# Altium project TFT-ES32-V1.1.PrjPcb
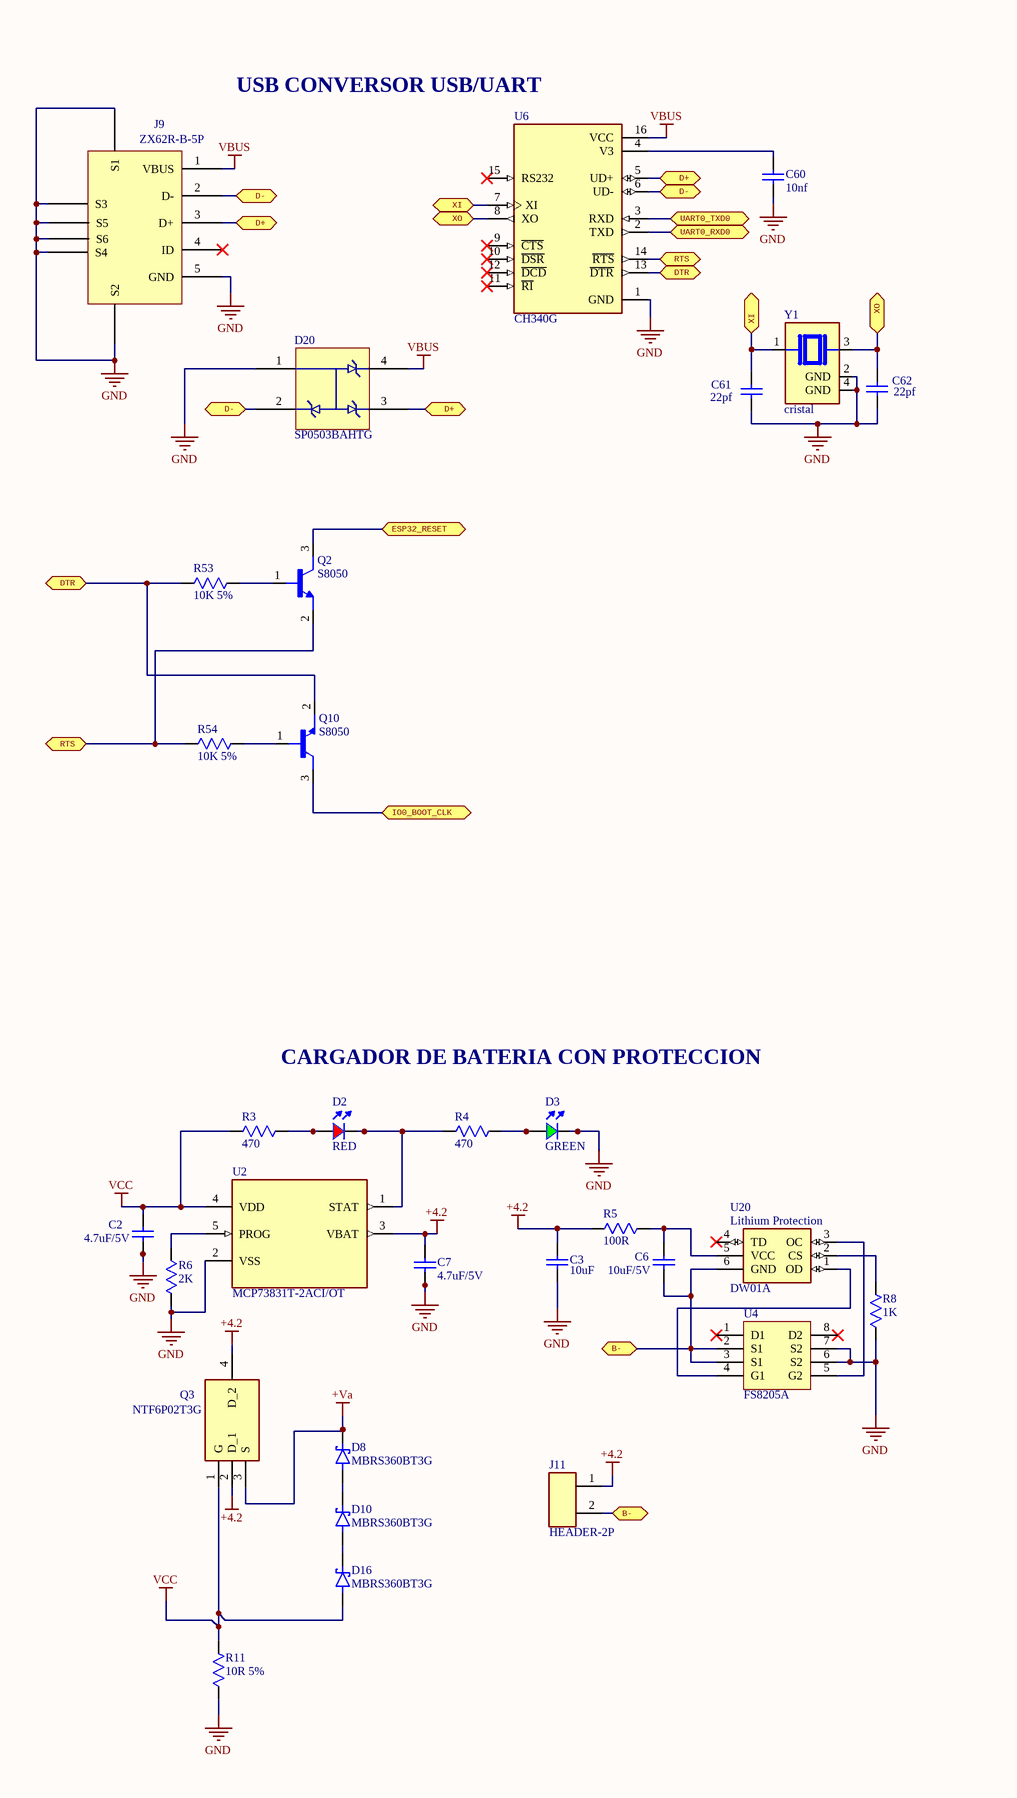
[diagram p0: TFT-ES32-V1.1.SchDoc, left]
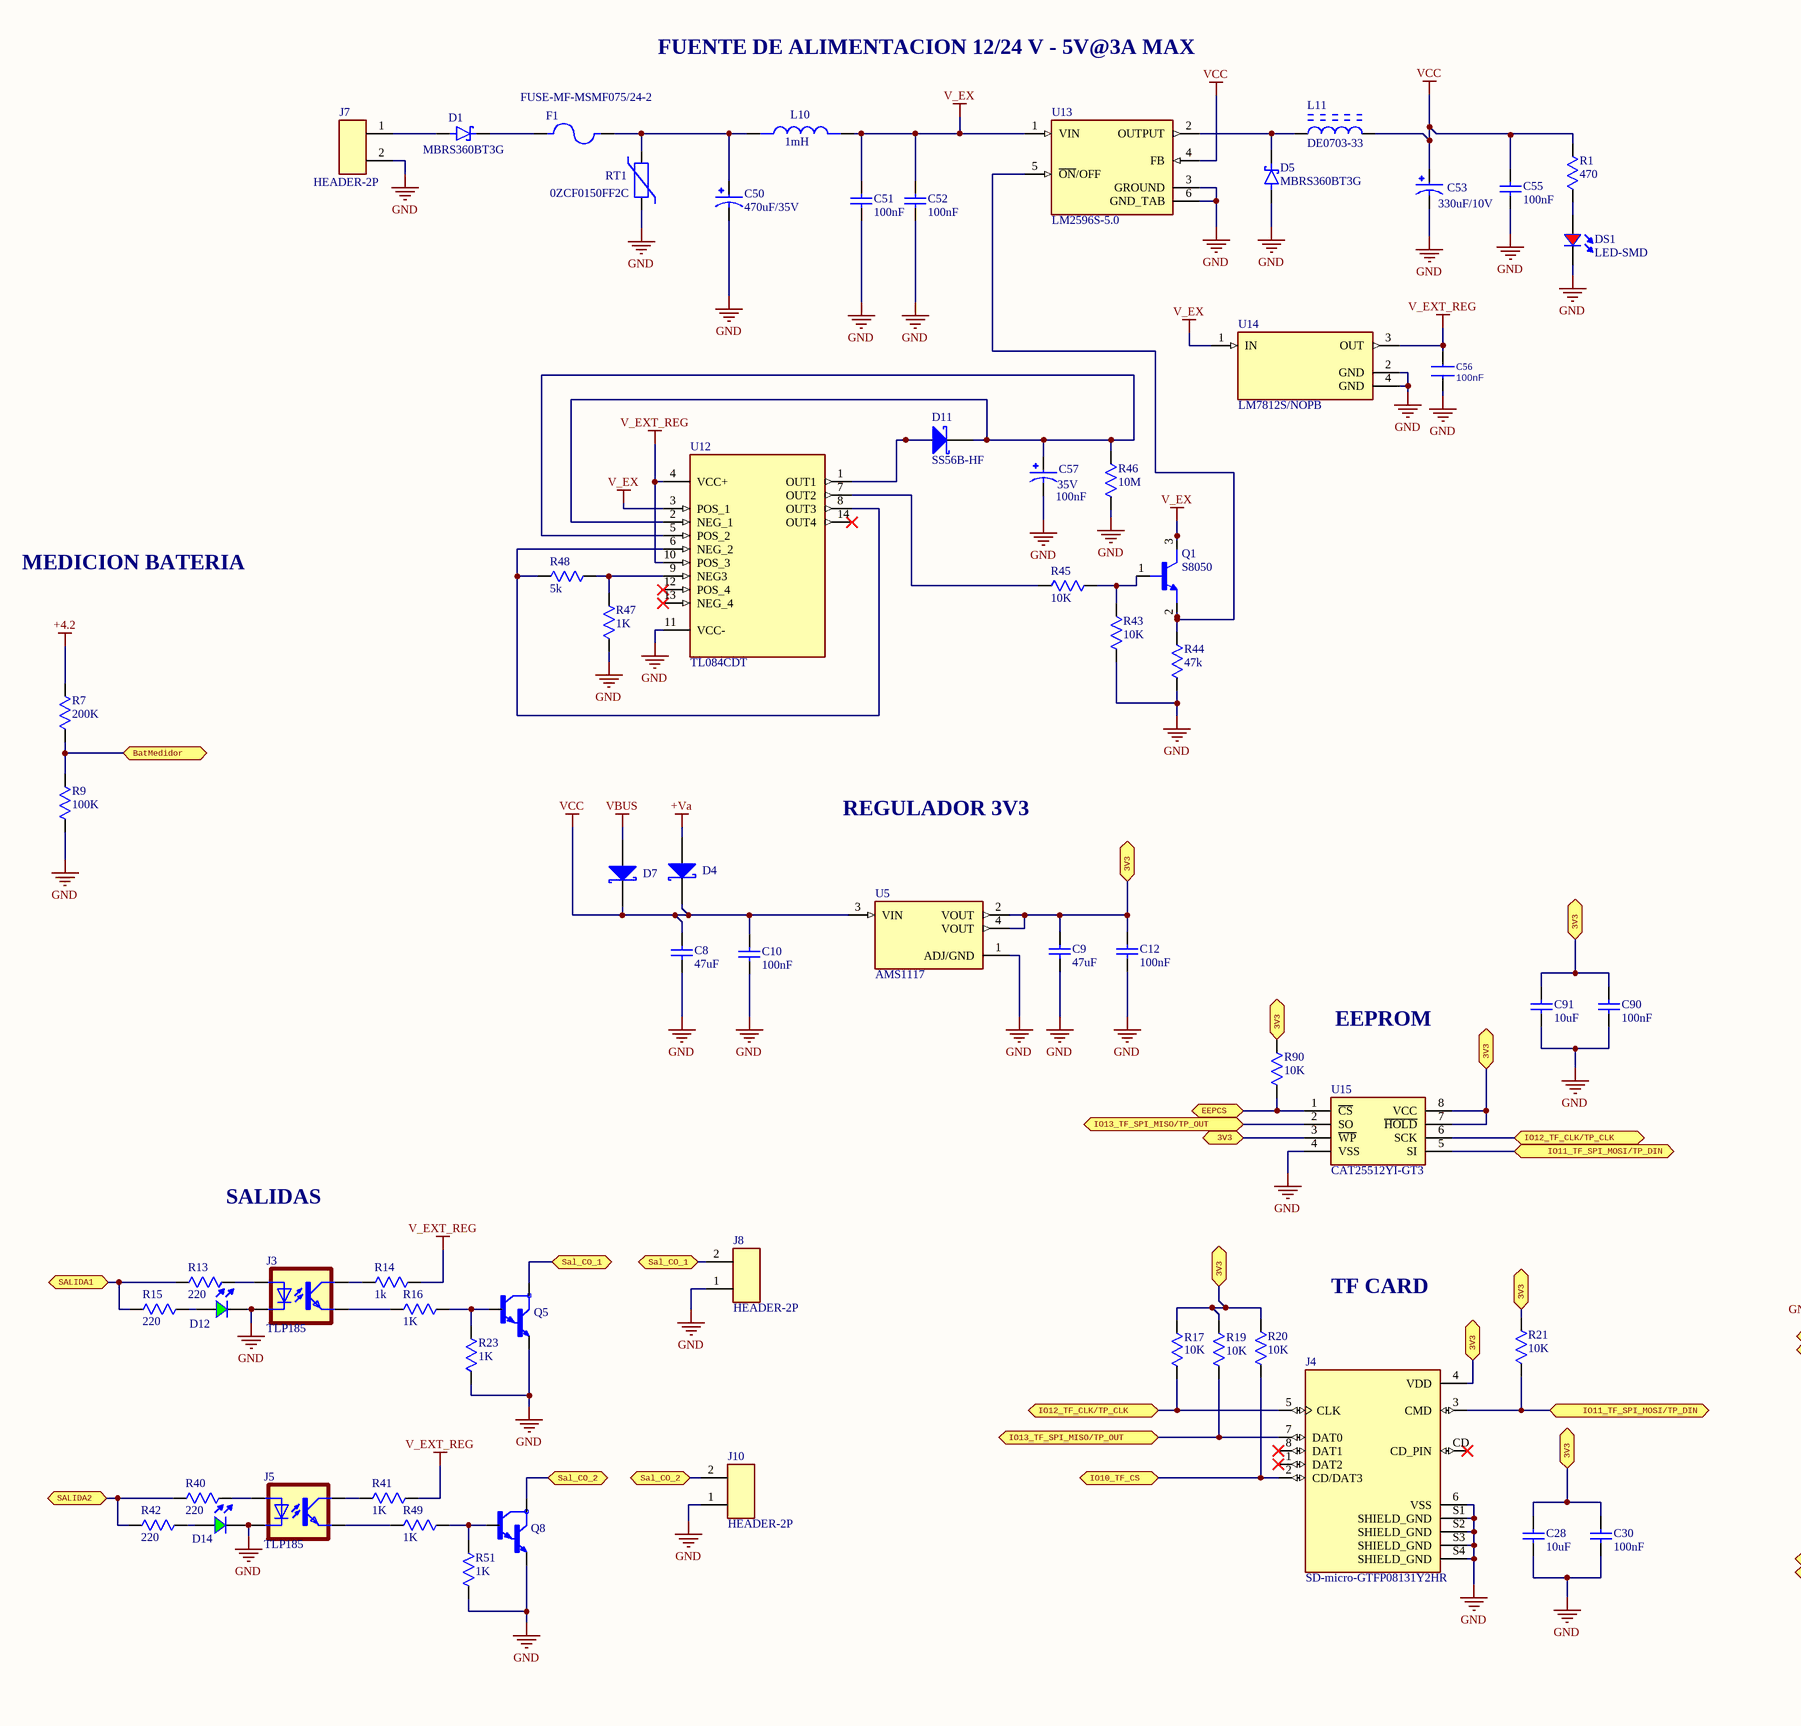
[diagram p1: TFT-ES32-V1.1.SchDoc, middle]
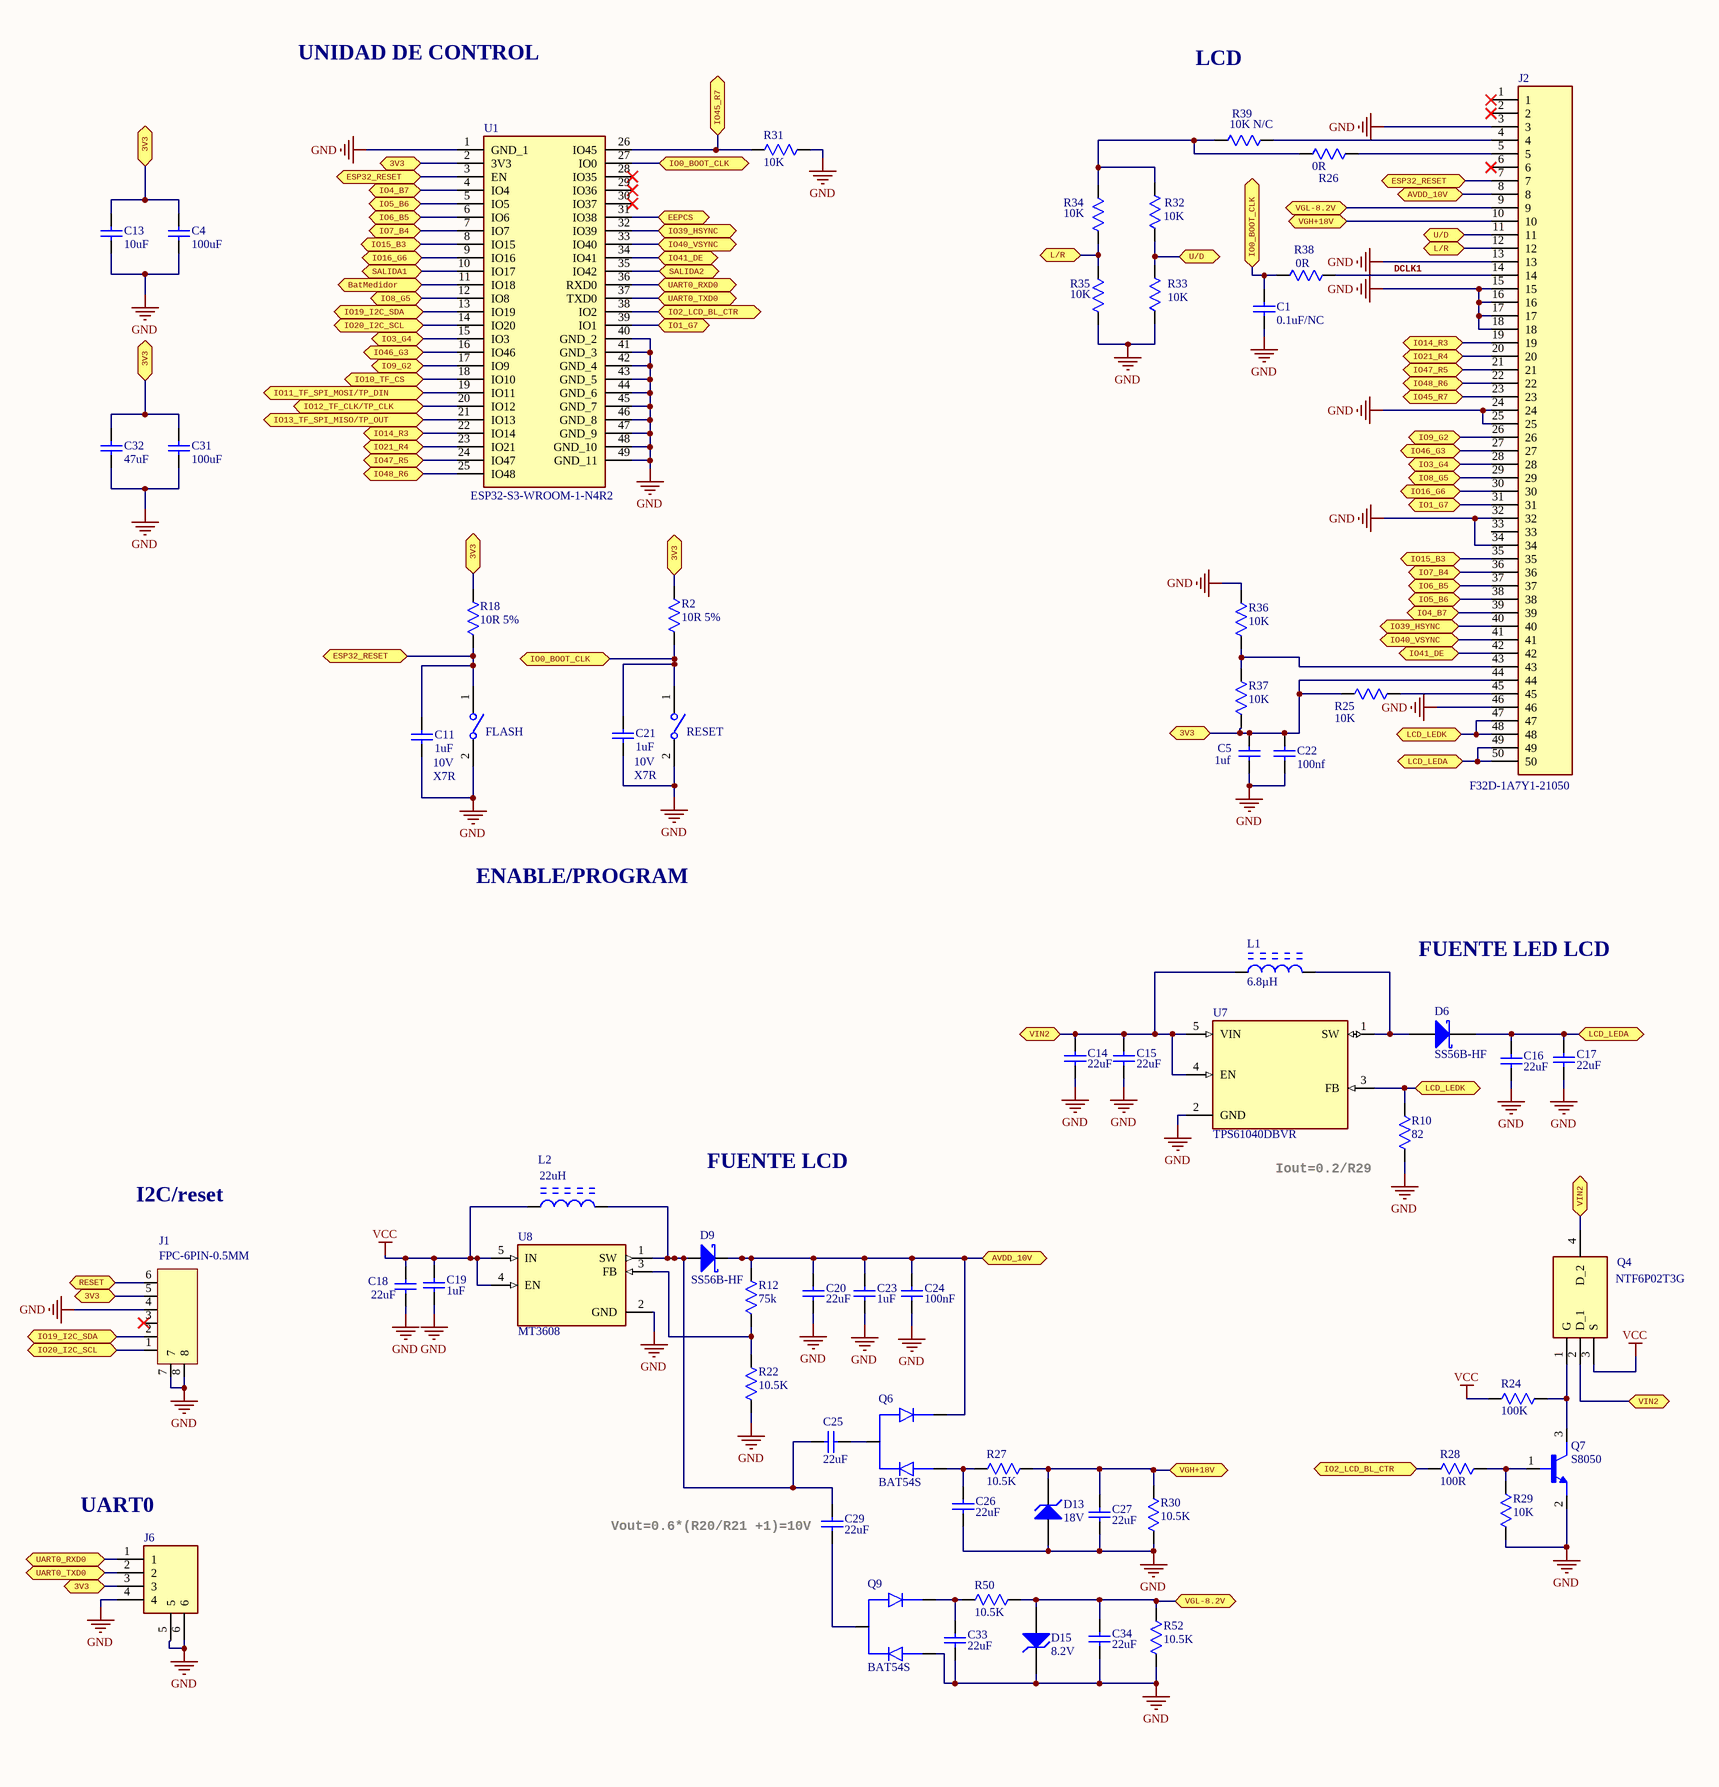
[diagram p2: TFT-ES32-V1.1.SchDoc, right]
1 sheet, 161 parts. Net scope: flat (ports and power ports of the same name join across sheets).
Board file: TFT-ES32-V1.1.PcbDoc

## Sheet TFT-ES32-V1.1.SchDoc
size 855 x 346 mm

### Parts
C1  0.1uF/NC  [C_0805-3D]
C2  4.7uF/5V  [C_0805-3D]
C3  10uF  [C_0805-3D]
C4  100uF  [C_0805-3D]
C5  1uf  [C_0805-3D]
C6  10uF/5V  [C_0805-3D]
C7  4.7uF/5V  [C_0805-3D]
C8  47uF  [C_0805-3D]
C9  47uF  [C_0805-3D]
C10  100nF  [C_0805-3D]
C11  1uF  tension: 10V  tipo: X7R  [C_0805-3D]
C12  100nF  [C_0805-3D]
C13  10uF  [C_0805-3D]
C14  value 22uF  [C_0805-3D]  (hidden comment: capacitor caramico)
C15  value 22uF  [C_0805-3D]  (hidden comment: capacitor caramico)
C16  value 22uF  [C_0805-3D]  (hidden comment: capacitor caramico)
C17  value 22uF  [C_0805-3D]  (hidden comment: capacitor caramico)
C18  value 22uF  [C_0805-3D]  (hidden comment: capacitor caramico)
C19  value 1uF  [C_0805-3D]  (hidden comment: capacitor caramico)
C20  value 22uF  [C_0805-3D]  (hidden comment: capacitor caramico)
C21  1uF  tension: 10V  tipo: X7R  [C_0805-3D]
C22  100nf  [C_0805-3D]
C23  value 1uF  [C_0805-3D]  (hidden comment: capacitor caramico)
C24  value 100nF  [C_0805-3D]  (hidden comment: capacitor caramico)
C25  value 22uF  [C_0805-3D]  (hidden comment: capacitor caramico)
C26  value 22uF  [C_0805-3D]  (hidden comment: capacitor caramico)
C27  value 22uF  [C_0805-3D]  (hidden comment: capacitor caramico)
C28  10uF  [C_0805-3D]
C29  value 22uF  [C_0805-3D]  (hidden comment: capacitor caramico)
C30  100nF  [C_0805-3D]
C31  100uF  [C_0805-3D]
C32  47uF  [C_0805-3D]
C33  value 22uF  [C_0805-3D]  (hidden comment: capacitor caramico)
C34  value 22uF  [C_0805-3D]  (hidden comment: capacitor caramico)
C50  470uF/35V  [CAP_EEEFP1V221AV - duplicate]
C51  100nF  [C_0805-3D]
C52  100nF  [C_0805-3D]
C53  330uF/10V  [CAP_EEEFP1V221AV - duplicate]
C55  100nF  [C_0805-3D]
C56  100nF  [C_0805]
C57  value 100nF  max volt: 35V  [CAP_EEEFP1V221AV - duplicate]  (hidden comment: CAP)
C60  10nf  [C_0805-3D]
C61  value 22pf  [C_0805-3D]  (hidden comment: capacitor caramico)
C62  value 22pf  [C_0805-3D]  (hidden comment: capacitor caramico)
C90  100nF  [C_0805-3D]
C91  10uF  [C_0805-3D]
D1  MBRS360BT3G  [DIOM5436X247N]
D2  RED  [D_0805-RED]
D3  GREEN  [D_0805-GREEN]
D4  SS56B-HF  [SS56B-HF DO-214AA (SMB)]  (value not drawn)
D5  MBRS360BT3G  [DIOM5436X247N]
D6  SS56B-HF  [SS56B-HF DO-214AA (SMB)]
D7  SS56B-HF  [SS56B-HF DO-214AA (SMB)]  (value not drawn)
D8  MBRS360BT3G  [DIOM5436X247N]
D9  SS56B-HF  [SS56B-HF DO-214AA (SMB)]
D10  MBRS360BT3G  [DIOM5436X247N]
D11  SS56B-HF  [SS56B-HF DO-214AA (SMB)]
D12  LTST-C171GKT  [D_0805-GREEN]  (value not drawn)
D13  18V  [SOD_123]
D14  LTST-C171GKT  [D_0805-GREEN]  (value not drawn)
D15  8.2V  [SOD_123]
D16  MBRS360BT3G  [DIOM5436X247N]
D20  SP0503BAHTG  [SOT143]
DS1  LED-SMD  [D_0805-RED]
F1  FUSE-MF-MSMF075/24-2  [FUSER_MF-MSMF075/24-2]
FLASH  buton-SMD  [SW_147873-2]  (value not drawn)
J1  FPC-6PIN-0.5MM  [68710614022]
J2  F32D-1A7Y1-21050  [AMPHENOL_F32D-1A7Y1-21050]
J3  TLP185  [SOP-4-2.54MM]
J4  SD-micro-GTFP08131Y2HR  [AMPHENOL_GTFP08131Y2HR]
J5  TLP185  [SOP-4-2.54MM]
J6  CONEC-4P-0.5MM-59453-041110ECHLF  [AMPHENOL_59453-041110ECHLF]  (value not drawn)
J7  HEADER-2P  [620102131822]
J8  HEADER-2P  [620102131822]
J9  ZX62R-B-5P  [HRS_ZX62R-B-5P]
J10  HEADER-2P  [620102131822]
J11  HEADER-2P  [620102131822]
L1  6.8µH  [DE0703-33]
L2  value 22uH  [DE0703-33]  (hidden comment: DE0703-33)
L10  1mH  [INDM5650X530N]
L11  DE0703-33  [DE0703-33]
Q1  S8050  [SOT-23]
Q2  S8050  [SOT-23]
Q3  NTF6P02T3G  [SOT230P700X175-4N]
Q4  NTF6P02T3G  [SOT230P700X175-4N]
Q5  MJD122  [DPAK]  (value not drawn)
Q6  BAT54S  [SOT95P240X120-3N]
Q7  S8050  [SOT-23]
Q8  MJD122  [DPAK]  (value not drawn)
Q9  BAT54S  [SOT95P240X120-3N]
Q10  S8050  [SOT-23]
R1  470  [R_0805]
R2  10R 5%  [R_0805]
R3  470  [R_0805]
R4  470  [R_0805]
R5  100R  [R_0805]
R6  2K  [R_0805]
R7  200K  [R_0805]
R8  1K  [R_0805]
R9  100K  [R_0805]
R10  82  [R_0805]
R11  10R 5%  [R_0805]
R12  75k  [R_0805]
R13  220  [R_0805]
R14  1k  [R_0805]
R15  220  [R_0805]
R16  1K  [R_0805]
R17  10K  [R_0805]
R18  10R 5%  [R_0805]
R19  10K  [R_0805]
R20  10K  [R_0805]
R21  10K  [R_0805]
R22  10.5K  [R_0805]
R23  1K  [R_0805]
R24  100K  [R_0805]
R25  10K  [R_0805]
R26  0R  [R_0805]
R27  10.5K  [R_0805]
R28  100R  [R_0805]
R29  10K  [R_0805]
R30  10.5K  [R_0805]
R31  10K  [R_0805]
R32  10K  [R_0805]
R33  10K  [R_0805]
R34  10K  [R_0805]
R35  10K  [R_0805]
R36  10K  [R_0805]
R37  10K  [R_0805]
R38  0R  [R_0805]
R39  10K N/C  [R_0805]
R40  220  [R_0805]
R41  1K  [R_0805]
R42  220  [R_0805]
R43  10K  [R_0805]
R44  47k  [R_0805]
R45  10K  [R_0805]
R46  10M  [R_0805]
R47  1K  [R_0805]
R48  5k  [R_0805]
R49  1K  [R_0805]
R50  10.5K  [R_0805]
R51  1K  [R_0805]
R52  10.5K  [R_0805]
R53  10K 5%  [R_0805]
R54  10K 5%  [R_0805]
R90  10K  [R_0805]
RESET  buton-SMD  [SW_147873-2]  (value not drawn)
RT1  0ZCF0150FF2C  [0ZCF]
U1  ESP32-S3-WROOM-1-N4R2  [ESP32S3WROOM1N4R2]
U2  MCP73831T-2ACI/OT  [SOT95P280X145-5N]
U4  FS8205A  [SOP65P640X120-8N]
U5  AMS1117  [SOT229P700X180-4N]
U6  CH340G  [SOIC127P600X180-16N]
U7  TPS61040DBVR  [SOT95P280X145-5N]
U8  MT3608  [SOT95P280X145-6N]
U12  TL084CDT  [SOIC127P600X175-14N]
U13  LM2596S-5.0  [TO170P1524X483-6N]
U14  LM7812S/NOPB  [TO254P1524X483-4N]
U15  CAT25512YI-GT3  [SOP65P640X120-8N]
U20  DW01A  [SOT-23-6]
Y1  cristal  [XTAL_ABM8G25000MHZB4YT3]

### Ports
3V3, AVDD_10V, B-, BatMedidor, D+, D-, DTR, EEPCS, ESP32_RESET, IO0_BOOT_CLK, IO1_G7, IO2_LCD_BL_CTR, IO3_G4, IO4_B7, IO5_B6, IO6_B5, IO7_B4, IO8_G5, IO9_G2, IO10_TF_CS, IO11_TF_SPI_MOSI/TP_DIN, IO12_TF_CLK/TP_CLK, IO13_TF_SPI_MISO/TP_OUT, IO14_R3, IO15_B3, IO16_G6, IO19_I2C_SDA, IO20_I2C_SCL, IO21_R4, IO39_HSYNC, IO40_VSYNC, IO41_DE, IO45_R7, IO46_G3, IO47_R5, IO48_R6, L/R, LCD_LEDA, LCD_LEDK, RESET, RTS, Sal_CO_1, Sal_CO_2, SALIDA1, SALIDA2, U/D, UART0_RXD0, UART0_TXD0, VGH+18V, VGL-8.2V, VIN2, XI, XO

### Nets
+4.2: C3.1 C7.2 J11.1 Q3.2(D_1) Q3.4(D_2) R5.2 R7.2 U2.3(VBAT)
+Va: D4.1 D8.C(K) Q3.3(S)
GND: C1.1 C2.1 C3.2 C4.1 C5.1 C7.1 C8.2 C9.2 C10.1 C11.1 C12.1 C13.2 C14.1 C15.1 C16.1 C17.1 C18.2 C19.1 C20.1 C21.1 C22.1 C23.1 C24.1 C26.1 C27.1 C28.2 C30.1 C31.1 C32.2 C33.1 C34.1 C50.2 C51.2 C52.1 C53.2 C55.1 C56.1 C57.2 C60.1 C61.1 C62.1 C90.1 C91.2 D3.2 D5.A D12.2 D13.1 D14.2 D15.2 D20.1 DS1.2 FLASH.2 J1.4 J1.7 J1.8 J2.3 J2.13 J2.15 J2.16 J2.17 J2.18 J2.24 J2.25 J2.32 J2.34 J2.46 J3.CATHODE(C) J4.6(VSS) J4.S1(SHIELD_GND) J4.S2(SHIELD_GND) J4.S3(SHIELD_GND) J4.S4(SHIELD_GND) J5.CATHODE(C) J6.4 J6.5 J6.6 J7.2 J8.1 J9.5(GND) J9.12(S1) J9.13(S3) J9.14(S5) J9.15(S6) J9.16(S2) J9.17(S4) J10.1 Q5.3(E) Q7.2(E) Q8.3(E) Q9.1 R6.1 R8.1 R9.1 R10.1 R11.2 R22.1 R23.1 R29.1 R30.1 R31.2 R33.1 R35.1 R36.2 R43.1 R44.1 R46.1 R47.1 R51.2 R52.1 RESET.2 RT1.1 U1.1(GND_1) U1.40(GND_2) U1.41(GND_3) U1.42(GND_4) U1.43(GND_5) U1.44(GND_6) U1.45(GND_7) U1.46(GND_8) U1.47(GND_9) U1.48(GND_10) U1.49(GND_11) U2.2(VSS) U4.6(S2) U4.7(S2) U5.1(ADJ/GND) U6.1(GND) U7.2(GND) U8.2(GND) U12.11(VCC-) U13.3(GROUND) U13.6(GND_TAB) U14.2(GND) U14.4(GND) U15.4(VSS) Y1.2(GND) Y1.4(GND)
V_EX: C51.1 C52.2 L10.2 Q1.3(C) U12.3(POS_1) U13.1(VIN) U14.1(IN)
V_EXT_REG: C56.2 R14.2 R41.1 U12.4(VCC+) U12.10(POS_3) U14.3(OUT)
VBUS: D7.1 D20.4 J9.1(VBUS) U6.16(VCC)
VCC: C2.2 C8.1 C10.2 C18.1 C19.2 C53.1 C55.2 D4.2 D7.2 D16.A L2.1 L11.2 Q3.1(G) Q4.3(S) R1.2 R3.1 R11.1 R24.2 U2.4(VDD) U5.3(VIN) U8.4(EN) U8.5(IN) U13.4(FB)
DCLK1: J2.14 R38.2
NetC1_2: C1.2 C21.2 Q10.3 R2.1 R38.1 RESET.1 U1.27(IO0) ; port IO0_BOOT_CLK
NetC4_2: C4.2 C5.2 C9.1 C12.2 C13.1 C22.2 C28.1 C30.2 C31.2 C32.1 C90.2 C91.1 J1.5 J2.44 J4.4(VDD) J6.3 R2.2 R17.2 R18.2 R19.2 R20.2 R21.2 R25.2 R37.1 R90.2 U1.2(3V3) U5.2(VOUT) U5.4(VOUT) U15.3(~{WP}) U15.7(~{HOLD}) U15.8(VCC) ; port 3V3
NetC6_1: C6.1 R5.1 U20.5(VCC)
NetC6_2: C6.2 J11.2 U4.2(S1) U4.3(S1) U20.6(GND) ; port B-
NetC11_2: C11.2 FLASH.1 J2.7 Q2.3(C) R18.1 U1.3(EN) ; port ESP32_RESET
NetC14_2: C14.2 C15.2 L1.1 Q4.2(D_1) Q4.4(D_2) U7.4(EN) U7.5(VIN) ; port VIN2
NetC16_2: C16.2 C17.2 D6.2 J2.49 J2.50 ; port LCD_LEDA
NetC20_2: C20.2 C23.2 C24.2 D9.2 J2.8 Q6.2 R12.2 ; port AVDD_10V
NetC25_1: C25.1 Q6.3
NetC25_2: C25.2 C29.2 D9.1 L2.2 U8.1(SW)
NetC26_2: C26.2 Q6.1 R27.2
NetC27_2: C27.2 D13.2 J2.10 R27.1 R30.2 ; port VGH+18V
NetC29_1: C29.1 Q9.3
NetC33_2: C33.2 Q9.2 R50.2
NetC34_2: C34.2 D15.1 J2.9 R50.1 R52.2 ; port VGL-8.2V
NetC50_1: C50.1 F1.2 L10.1 RT1.2
NetC57_1: C57.1 D11.2 R46.2 U12.2(NEG_1) U12.5(POS_2)
NetC60_2: C60.2 U6.4(V3)
NetC61_2: C61.2 U6.7(XI) Y1.1 ; port XI
NetC62_2: C62.2 U6.8(XO) Y1.3 ; port XO
NetD1_A: D1.A J7.1
NetD1_C: D1.C(K) F1.1
NetD2_1: D2.1 R3.2
NetD2_2: D2.2 R4.1 U2.1(STAT)
NetD3_1: D3.1 R4.2
NetD5_C: D5.C(K) L11.1 U13.2(OUTPUT)
NetD6_1: D6.1 L1.2 U7.1(SW)
NetD8_A: D8.A D10.C(K)
NetD10_A: D10.A D16.C(K)
NetD11_1: D11.1 U12.1(OUT1)
NetD12_1: D12.1 R15.2
NetD14_1: D14.1 R42.1
NetD20_2: D20.2 J9.2(D-) U6.6(UD-) ; port D-
NetD20_3: D20.3 J9.3(D+) U6.5(UD+) ; port D+
NetDS1_1: DS1.1 R1.1
NetJ1_1: J1.1 U1.14(IO20) ; port IO20_I2C_SCL
NetJ1_2: J1.2 U1.13(IO19) ; port IO19_I2C_SDA
NetJ1_6: J1.6 ; port RESET
NetJ2_4: J2.4 R39.2
NetJ2_5: J2.5 R26.2
NetJ2_11: J2.11 R32.1 R33.2 ; port U/D
NetJ2_12: J2.12 R34.1 R35.2 ; port L/R
NetJ2_19: J2.19 U1.22(IO14) ; port IO14_R3
NetJ2_20: J2.20 U1.23(IO21) ; port IO21_R4
NetJ2_21: J2.21 U1.24(IO47) ; port IO47_R5
NetJ2_22: J2.22 U1.25(IO48) ; port IO48_R6
NetJ2_23: J2.23 R31.1 U1.26(IO45) ; port IO45_R7
NetJ2_26: J2.26 U1.17(IO9) ; port IO9_G2
NetJ2_27: J2.27 U1.16(IO46) ; port IO46_G3
NetJ2_28: J2.28 U1.15(IO3) ; port IO3_G4
NetJ2_29: J2.29 U1.12(IO8) ; port IO8_G5
NetJ2_30: J2.30 U1.9(IO16) ; port IO16_G6
NetJ2_31: J2.31 U1.39(IO1) ; port IO1_G7
NetJ2_35: J2.35 U1.8(IO15) ; port IO15_B3
NetJ2_36: J2.36 U1.7(IO7) ; port IO7_B4
NetJ2_37: J2.37 U1.6(IO6) ; port IO6_B5
NetJ2_38: J2.38 U1.5(IO5) ; port IO5_B6
NetJ2_39: J2.39 U1.4(IO4) ; port IO4_B7
NetJ2_40: J2.40 U1.32(IO39) ; port IO39_HSYNC
NetJ2_41: J2.41 U1.33(IO40) ; port IO40_VSYNC
NetJ2_42: J2.42 U1.34(IO41) ; port IO41_DE
NetJ2_43: J2.43 R36.1 R37.2
NetJ2_45: J2.45 R25.1
NetJ2_47: J2.47 J2.48 R10.2 U7.3(FB) ; port LCD_LEDK
NetJ3_ANODE: J3.ANODE(A) R13.2
NetJ3_COLLECTOR: J3.COLLECTOR(COL) R14.1
NetJ3_EMITTER: J3.EMITTER(EMIT) R16.1
NetJ4_2: J4.2(CD/DAT3) R20.1 U1.18(IO10) ; port IO10_TF_CS
NetJ4_3: J4.3(CMD) R21.1 U1.19(IO11) U15.5(SI) ; port IO11_TF_SPI_MOSI/TP_DIN
NetJ4_5: J4.5(CLK) R17.1 U1.20(IO12) U15.6(SCK) ; port IO12_TF_CLK/TP_CLK
NetJ4_7: J4.7(DAT0) R19.1 U1.21(IO13) U15.2(SO) ; port IO13_TF_SPI_MISO/TP_OUT
NetJ5_ANODE: J5.ANODE(A) R40.1
NetJ5_COLLECTOR: J5.COLLECTOR(COL) R41.2
NetJ5_EMITTER: J5.EMITTER(EMIT) R49.2
NetJ6_1: J6.1 U1.36(RXD0) U6.2(TXD) ; port UART0_RXD0
NetJ6_2: J6.2 U1.37(TXD0) U6.3(RXD) ; port UART0_TXD0
NetJ8_2: J8.2 Q5.4(C) ; port Sal_CO_1
NetJ10_2: J10.2 Q8.4(C) ; port Sal_CO_2
NetQ1_1: Q1.1(B) R43.2 R45.2
NetQ1_2: Q1.2(E) R44.2 U13.5(~{ON}/OFF)
NetQ2_1: Q2.1(B) R53.2
NetQ2_2: Q2.2(E) R54.1 U6.14(~{RTS}) ; port RTS
NetQ4_1: Q4.1(G) Q7.3(C) R24.1
NetQ5_1: Q5.1(B) R16.2 R23.2
NetQ7_1: Q7.1(B) R28.1 R29.2
NetQ8_1: Q8.1(B) R49.1 R51.1
NetQ10_1: Q10.1(B) R54.2
NetQ10_2: Q10.2(E) R53.1 U6.13(~{DTR}) ; port DTR
NetR6_2: R6.2 U2.5(PROG)
NetR7_1: R7.1 R9.2 U1.11(IO18) ; port BatMedidor
NetR8_2: R8.2 U20.2(CS)
NetR12_1: R12.1 R22.2 U8.3(FB)
NetR13_1: R13.1 R15.1 U1.10(IO17) ; port SALIDA1
NetR26_1: R26.1 R32.2 R34.2 R39.1
NetR28_2: R28.2 U1.38(IO2) ; port IO2_LCD_BL_CTR
NetR40_2: R40.2 R42.2 U1.35(IO42) ; port SALIDA2
NetR45_1: R45.1 U12.7(OUT2)
NetR47_2: R47.2 R48.2 U12.9(NEG3)
NetR48_1: R48.1 U12.6(NEG_2) U12.8(OUT3)
NetR90_1: R90.1 U1.31(IO38) U15.1(~{CS}) ; port EEPCS
NetU4_4: U4.4(G1) U20.1(OD)
NetU4_5: U4.5(G2) U20.3(OC)

Not connected (* = marked no-connect by the designer): J1 3(4)*; J2 1* 2* 6* 33; J4 1(DAT2)* 8(DAT1)* CD(CD_PIN)*; J9 4(ID)*; U1 28(IO35)* 29(IO36)* 30(IO37)*; U4 1(D1)* 8(D2)*; U6 9(~{CTS})* 10(~{DSR})* 11(~{RI})* 12(~{DCD})* 15(RS232)*; U12 12(POS_4)* 13(NEG_4)* 14(OUT4)*; U20 4(TD)*

### Notes on the sheet
- FUENTE DE ALIMENTACION 12/24 V - 5V@3A MAX
- UNIDAD DE CONTROL
- LCD
- USB CONVERSOR USB/UART
- MEDICION BATERIA
- REGULADOR 3V3
- ENABLE/PROGRAM
- FUENTE LED LCD
- EEPROM
- CARGADOR DE BATERIA CON PROTECCION
- FUENTE LCD
- Iout=0.2/R29
- SALIDAS
- I2C/reset
- TF CARD
- (near J6) UART0
- Vout=0.6*(R20/R21 +1)=10V
- (in symbol DW01A) Lithium Protection

### Library data of the parts
C1-C34 C51 C52 C55 C60-C62 C90 C91 = capacitor caramico: capacitor ceramico 0805
C50 C53 = CAP_EEEFP1V221AV: CAP ALUM; max volt: 50V
C56 = CapMix: Capacitor; Value: 100nF
C57 = CAP_EEEFP1V221AV: CAP ALUM
D1 D5 D8 D10 D16 = MBRS360BT3G: Diode Schottky 60V 3A Surface Mount SMB
D2 DS1 = LED-SMD: led 0805 red
D3 = LED-SMD-GREEN: value: LTST-C171GKT
D4 D6 D7 D9 D11 = SS56B-HF: Diodo Schottky 60 V 5A Montaje en superficie DO-214AA (SMB); part number: SS56B-HF; value: Diodo Schottky 60 V 5A; pakage: DO-214AA (SMB)
D12 D14 = LED-SMD-GREEN
D13 = Diodo Zener-MMSZ5231BT1G: Diodo Zener 18V SMD SOD-123
D15 = Diodo Zener-MMSZ5231BT1G: Diodo Zener  8.2V  SOD-123
D20 = SP0503BAHTG: Supresor ESD TVS Uni-Dir 5.5V 4-Pin SOT-143 T/R
F1 = FUSE-MF-MSMF075/24-2: Polymeric PTC Resettable Fuse 24V 750 mA Ih Surface Mount 1812 (4532 Metric), Concave
J1 = FPC-CONEC-6P-68710614022: Position FPC Connector Contacts, Top 0.020" (0.50mm) Surface Mount, Right Angle
J2 = F32D-1A7Y1-21050: Flex Connector, 0.50mm Pitch, Height 2.00mm, Right angle, Flip type, ZIF, Double contact, point 50 position , Without MYLAR; MF: Amphenol ICC (FCI); Package: None; Price: None; Check_prices: https://www.snapeda.com/parts/F32D-1A7Y1-21050/Amphenol+FCI/view-part/?ref=eda; Value: *; SnapEDA_Link: https://www.snapeda.com/parts/F32D-1A7Y1-21050/Amphenol+FCI/view-part/?ref=snap; MP: F32D-1A7Y1-21050; Availability: In Stock; Purchase-URL: https://pricing.snapeda.com/search?q=F32D-1A7Y1-21050&ref=eda
J3 J5 = TLP185: Optoisolator Transistor Output 3750Vrms 1 Channel 6-SOP; MF: Toshiba; Price: None; Availability: In Stock; MP: TLP185; Package: None; SnapEDA_Link: https://www.snapeda.com/parts/TLP185/Toshiba/view-part/?ref=snap; Check_prices: https://www.snapeda.com/parts/TLP185/Toshiba/view-part/?ref=eda; Value: *; Purchase-URL: https://pricing.snapeda.com/search/part/TLP185/?ref=eda
J4 = SD-micro-GTFP08131Y2HR: GTFP08131Y2HR  MICRO SD,P/P,LCP; MF: GTFP08131Y2HR
J6 = CONEC-4P-0.5MM-59453-041110ECHLF: 0.50mm Flex Connectors, FPC/FFC Side Entry ZIF Connector, Surface Mount, 4 Positions, Bottom Contact, 0.50mm (0.020in) Pitch
J7 J8 J10 J11 = HEADER-2P-620102131822: Connector Header Surface Mount, Right Angle 2 position 0.079 _2.00mm_
J9 = USB-ZX62R-B-5P: ZX62R-B-5P USB STM; tecnoligi: SMD; value: ZX62R-B-5P
L1 L2 L11 = DE0703-33: Inductor: alambre; SMD; 33uH; 910mA; 240 mΩ; 7,3x7,3x3,2 mm; ±20%
L10 = B82442T1105K050: INDUCTOR, 2220A, 1000UH, 0.246A, 10%; Inductance:1mH; Inductance Tolerance:Â± 10%; DC Resistance Max:9.5ohm; DC Current Rating:150mA; Series:SIMID; Core Material:Ferrite; Inductor Case Style:2220; No. of Pins:2; Core Material:Ferrite; DC Current Max:150mA; Inductor Type:Laser Cut; Package / Case:2220; Q @ Vr F:20; Q Factor @ Frequency:20 @ 252kHz; Resistance:9.5ohm; Resonant Frequency:1.8MHz
Q1 Q2 Q7 = transistor-smd-NPN-BJT: Transistor bipolar (BJT) NPN 25 V 500 mA 150 MHz 300 mW Montaje en superficie SOT-23
Q3 Q4 = NTF6P02T3G: 10A, 20V, 0.05ohm, P-CHANNEL, Si, POWER, MOSFET, TO-261AA, CASE 318E-04, TO-261, 4 PIN
Q5 Q8 = MJD122: Bipolar _BJT_ Transistor NPN - Darlington 100V 8A 4MHz 1.75W Surface Mount DPAK; MF: ON Semiconductor
Q6 Q9 = BAT54S: SOT-23 30V 0.2A Diodes Rectifi
Q10 = transistor-smd-NPN-BJT-espejado: Transistor bipolar (BJT) NPN 25 V 500 mA 150 MHz 300 mW Montaje en superficie SOT-23
R1-R54 R90 = Resistor
RT1 = 0ZCF0150FF2C: PPTC (Polyswitch); Vendor: Belfuse; Manufacturer_Part_Number: 0ZCF0150FF2C; Type: Type; RefDes: RefDes
U1 = ESP32-S3-WROOM-1-N4R2: Bluetooth, WiFi 802.11b/g/n, Bluetooth v5.0 Transceiver Module 2.4GHz PCB Trace Surface Mount
U2 = MCP73831T-2ACI/OT: Charger IC Lithium Ion/Polymer SOT-23-5; MF: Microchip; MP: MCP73831T-2ACI/OT; package: SOT-23 Microchip
U5 = AMS1117: 1A LOW DROPOUT VOLTAGE REGULATOR SOT-223; MP: AMS1117; MF: SOT-223
U6 = CH340G: USB Interface Integrated Circuit; MF: WCH; MP: CH340G
U7 = TPS61040DBVR: 28-V, 400-mA Switch Boost Converter in SOT-23 for LCD and White LED Applications
U8 = MT3608: High Efficiency 1.2MHz 2A Step Up Converter; MF: Aerosemi Technology Co., Ltd; MB: MT3608
U12 = TL084CDT: General purpose JFET quad operational amplifiers; MP: TL084CDT
U13 = LM2596S-5.0: SIMPLE SWITCHER&reg; 4.5V to 40V, 3A Low Component Count Step-Down Regulator
U14 = LM7812S/NOPB: 1.5-A, 30-V, linear voltage regulator 3-DDPAK/TO-263 0 to 125; MP: LM7812S/NOPB; pakage: 3-DDPAK/TO-263
U15 = CAT25512YI-GT3: EEPROM 512KB SPI SER CMOS EEPROM
U20 = DW01A: One Cell Lithium-ion/Polymer Battery Protection IC
Y1 = ABM8G25000MHZB4YT3: CRISTAL, SELLO DE VIDRIO CERAMICO, 25.000MHZ, 10PF, 30PPM @ 25C, 3; MF: Abracon; MP: ABM8G25000MHZB4YT3